# Altium schematic sheet DriverSPI.SchDoc
size A4
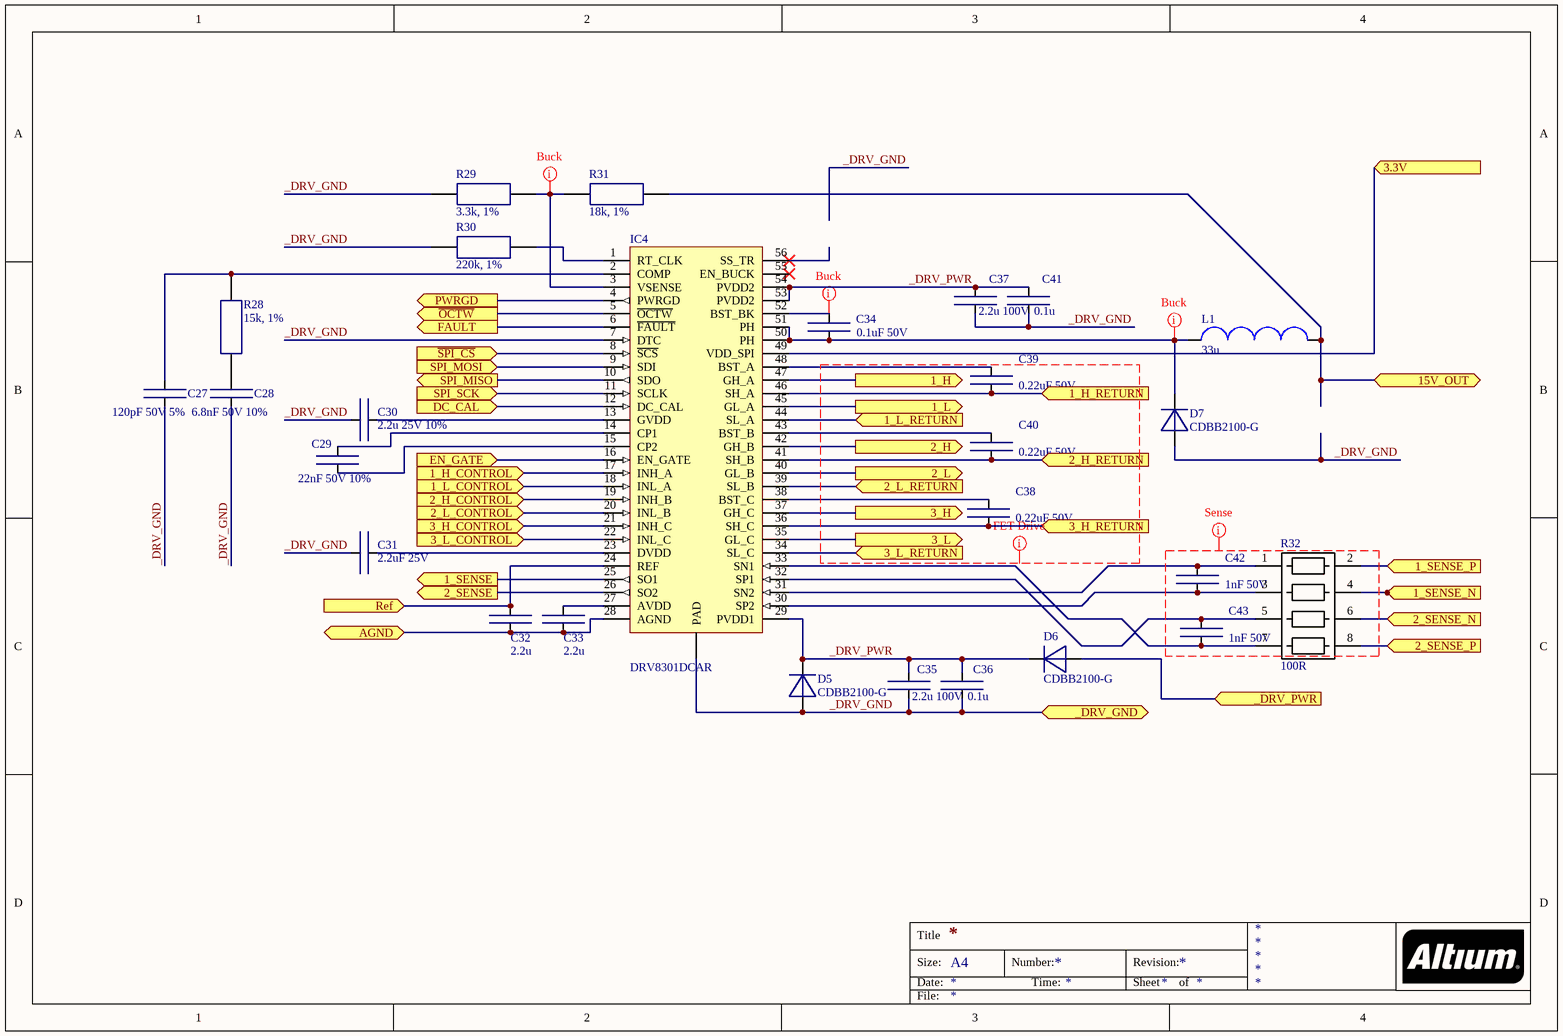
[diagram p0: DriverSPI.SchDoc]

## Parts
C27  120pF 50V 5%  [0402small]
C28  6.8nF 50V 10%  [0402small]
C29  22nF 50V 10%  [0402small]
C30  2.2u 25V 10%  [CAPC1608X08N(0603)]
C31  2.2uF 25V  [0603x]
C32  2.2u  [0603x]
C33  2.2u  [CAPC1608X08N(0603)]
C34  0.1uF 50V  [0402small]
C35  2.2u 100V  [EIA CC1210]
C36  0.1u  [C0805]
C37  2.2u 100V  [EIA CC1210]
C38  0.22uF 50V  [0402small]
C39  0.22uF 50V  [0402small]
C40  0.22uF 50V  [0402small]
C41  0.1u  [C0805]
C42  1nF 50V  [0402small]
C43  1nF 50V  [0402small]
D5  CDBB2100-G  [SMB_real]
D6  CDBB2100-G  [SMB_real]
D7  CDBB2100-G  [SMB_real]
IC4  DRV8301DCAR  [HTSSOP56(L)]
L1  33u  [DR74]
R28  15k, 1%  [0402small]
R29  3.3k, 1%  [0402small]
R30  220k, 1%  [0402small]
R31  18k, 1%  [0402small]
R32  100R  [RES_ARRAY_4X]

## Ports
1_H (out), 1_H_CONTROL (in), 1_H_RETURN (in), 1_L (out), 1_L_CONTROL (in), 1_L_RETURN (in), 1_SENSE (out), 1_SENSE_N (in), 1_SENSE_P (in), 2_H (out), 2_H_CONTROL (in), 2_H_RETURN (in), 2_L (out), 2_L_CONTROL (in), 2_L_RETURN (in), 2_SENSE (out), 2_SENSE_N (in), 2_SENSE_P (in), 3.3V (in), 3_H (out), 3_H_CONTROL (in), 3_H_RETURN (in), 3_L (out), 3_L_CONTROL (in), 3_L_RETURN (in), 15V_OUT, _DRV_GND (bidir), _DRV_PWR (in), AGND (bidir), DC_CAL (in), EN_GATE (in), FAULT (out), PWRGD (out), Ref (in), SPI_MISO (out), SPI_MOSI (in), SPI_SCK (in), ~{OCTW} (out), ~{SPI_CS} (in)

## Nets
1_H: IC4.47(GH_A) ; port 1_H
1_H_CONTROL: IC4.17(INH_A) ; port 1_H_CONTROL
1_H_RETURN: C39.1 IC4.46(SH_A) ; port 1_H_RETURN
1_L: IC4.45(GL_A) ; port 1_L
1_L_CONTROL: IC4.18(INL_A) ; port 1_L_CONTROL
1_L_RETURN: IC4.44(SL_A) ; port 1_L_RETURN
1_SENSE: IC4.25(SO1) ; port 1_SENSE
1_SENSE_N: R32.4 ; port 1_SENSE_N
1_SENSE_P: R32.2 ; port 1_SENSE_P
2_H: IC4.42(GH_B) ; port 2_H
2_H_CONTROL: IC4.19(INH_B) ; port 2_H_CONTROL
2_H_RETURN: C40.1 IC4.41(SH_B) ; port 2_H_RETURN
2_L: IC4.40(GL_B) ; port 2_L
2_L_CONTROL: IC4.20(INL_B) ; port 2_L_CONTROL
2_L_RETURN: IC4.39(SL_B) ; port 2_L_RETURN
2_SENSE: IC4.26(SO2) ; port 2_SENSE
2_SENSE_N: R32.6 ; port 2_SENSE_N
2_SENSE_P: R32.8 ; port 2_SENSE_P
3.3V: IC4.49(VDD_SPI) ; port 3.3V
3_H: IC4.37(GH_C) ; port 3_H
3_H_CONTROL: IC4.21(INH_C) ; port 3_H_CONTROL
3_H_RETURN: C38.1 IC4.36(SH_C) ; port 3_H_RETURN
3_L: IC4.35(GL_C) ; port 3_L
3_L_CONTROL: IC4.22(INL_C) ; port 3_L_CONTROL
3_L_RETURN: IC4.34(SL_C) ; port 3_L_RETURN
15V_OUT: L1.2 R31.1 ; port 15V_OUT
_DRV_GND: C27.1 C28.1 C30.1 C31.2 C35.2 C36.2 C37.2 C41.2 D5.1 D7.1 IC4.7(DTC) IC4.57(PAD) R29.2 R30.2 ; port _DRV_GND
_DRV_PWR: C35.1 C36.1 C37.1 C41.1 D5.2 D6.2 IC4.29(PVDD1) IC4.53(PVDD2) IC4.54(PVDD2)
_DRV_PWR: D6.1 ; port _DRV_PWR  [a separate net that carries the same name]
AGND: C32.2 C33.2 IC4.28(AGND) ; port AGND
DC_CAL: IC4.12(DC_CAL) ; port DC_CAL
EN_GATE: IC4.16(EN_GATE) ; port EN_GATE
FAULT: IC4.6(~{FAULT}) ; port FAULT
~{OCTW}: IC4.5(~{OCTW}) ; port ~{OCTW}
PWRGD: IC4.4(PWRGD) ; port PWRGD
Ref: C32.1 IC4.24(REF) ; port Ref
~{SPI_CS}: IC4.8(~{SCS}) ; port ~{SPI_CS}
SPI_MISO: IC4.10(SDO) ; port SPI_MISO
SPI_MOSI: IC4.9(SDI) ; port SPI_MOSI
SPI_SCK: IC4.11(SCLK) ; port SPI_SCK
NetC27_2: C27.2 IC4.2(COMP) R28.2
NetC28_2: C28.2 R28.1
NetC29_1: C29.1 IC4.14(CP1)
NetC29_2: C29.2 IC4.15(CP2)
NetC30_2: C30.2 IC4.13(GVDD)
NetC31_1: C31.1 IC4.23(DVDD)
NetC33_1: C33.1 IC4.27(AVDD)
NetC34_1: C34.1 D7.2 IC4.50(PH) IC4.51(PH) L1.1
NetC34_2: C34.2 IC4.52(BST_BK)
NetC38_2: C38.2 IC4.38(BST_C)
NetC39_2: C39.2 IC4.48(BST_A)
NetC40_2: C40.2 IC4.43(BST_B)
NetC42_1: C42.1 IC4.30(SP2) R32.3
NetC42_2: C42.2 IC4.31(SN2) R32.1
NetC43_1: C43.1 IC4.33(SN1) R32.7
NetC43_2: C43.2 IC4.32(SP1) R32.5
NetIC4_1: IC4.1(RT_CLK) R30.1
NetIC4_3: IC4.3(VSENSE) R29.1 R31.2

Not connected (* = marked no-connect by the designer): IC4 55(EN_BUCK)* 56(SS_TR)*

## Layout directives
net class Sense: (no net found under the mark)
net class FET Drive: (no net found under the mark)
net class Buck: NetC34_1, NetC34_2, NetIC4_3

## Notes on the sheet
- Title
- Size:
- Date:
- A4
- Number:
- Time:
- Revision:
- Sheet
- of
- File:

## Library data of the parts
C27 = Ceramic Chip Capacitor: Value: CAP CER 120PF 50V NP0 0402; Order Number: C0402C121J5GACTU; Distributor: Panasonic; Package: 0402
C28 = Ceramic Chip Capacitor: Value: CAP CER 6800PF 50V X7R 0402; Order Number: GRM155R71H682KA88D; Distributor: Murata; Package: 0402
C29 = Ceramic Chip Capacitor: Value: CAP CER 0.022UF 50V X7R 0402; Order Number: GRM155R71H223KA12D; Distributor: Murata Electronics; Package: 0402
C30-C33 = Ceramic Chip Capacitor: Value: CAP CER 2.2UF 25V X5R 0603; Order Number: GRM188R61E225KA12D; Distributor: Murata Electronics; Package: 0603
C34 = Ceramic Chip Capacitor: Value: CAP CER 0.1UF 50V X5R 0402; Order Number: C1005X5R1H104K050BB; Distributor: TDK Corporation; Package: 0402
C35 C37 = Ceramic Chip Capacitor: Value: CAP CER 2.2UF 100V X7R 1210; Order Number: C1210X225K1RACAUTO; Distributor: KEMET; Package: 1210
C36 C41 = Ceramic Chip Capacitor: Value: CAP CER 0.1UF 100V X7R 0805; Order Number: C0805C104K1RACTU; Distributor: KEMET; Package: 0805
C38-C40 = Ceramic Chip Capacitor: Value: CAP CER 0.22UF 50V X5R 0402; Order Number: UMK105BJ224KV-F; Distributor: Taiyo Yuden; Package: 0402
C42 C43 = Ceramic Chip Capacitor: Value: CAP CER 1000PF 50V C0G 0402; Order Number: CGA2B2C0G1H102J050BD; Distributor: TDK Corporation; Package: 0402
D5-D7 = ES1A...D: Value: SCHOTTKY 100V 2A DO214AA; Order Number: CDBB2100-G; Distributor: Comchip Technology; Package: SMB
IC4 = DRV8301: Value: DRV 8301 - IC MOTOR CONTROLLER SPI 56HTSSOP; Distributor: Texas Instruments; Order Number: DRV8301DCAR; Package: HTSSOP56
L1 = DR74: Value: FIXED IND 33UH 1.41A 143 MOHM; Order Number: DR74-330-R; Distributor: Eaton; Package: Nonstandard
R28 = SMD: Value: RES SMD 15K OHM 1% 1/10W 0402; Order Number: ERJ-2RKF1502X; Package: 0402; Distributor: Panasonic
R29 = SMD: Value: RES SMD 3.3K OHM 1% 1/10W 0402; Order Number: ERJ-2RKF3301X; Package: 0402; Distributor: Panasonic
R30 = SMD: Value: RES SMD 220K OHM 1% 1/10W 0402; Order Number: ERJ-2RKF2203X; Package: 0402; Distributor: Panasonic
R31 = SMD: Value: RES SMD 18K OHM 1% 1/10W 0402; Order Number: ERJ-2RKF1802X; Package: 0402; Distributor: Panasonic
R32 = RES_Array_4x: 742C0431000FP; Order Number: EXB-38V101JV; Value: RES ARRAY 4 RES 100 OHM 1206; Distributor: Panasonic; Package: 1206 (3216 Metric)